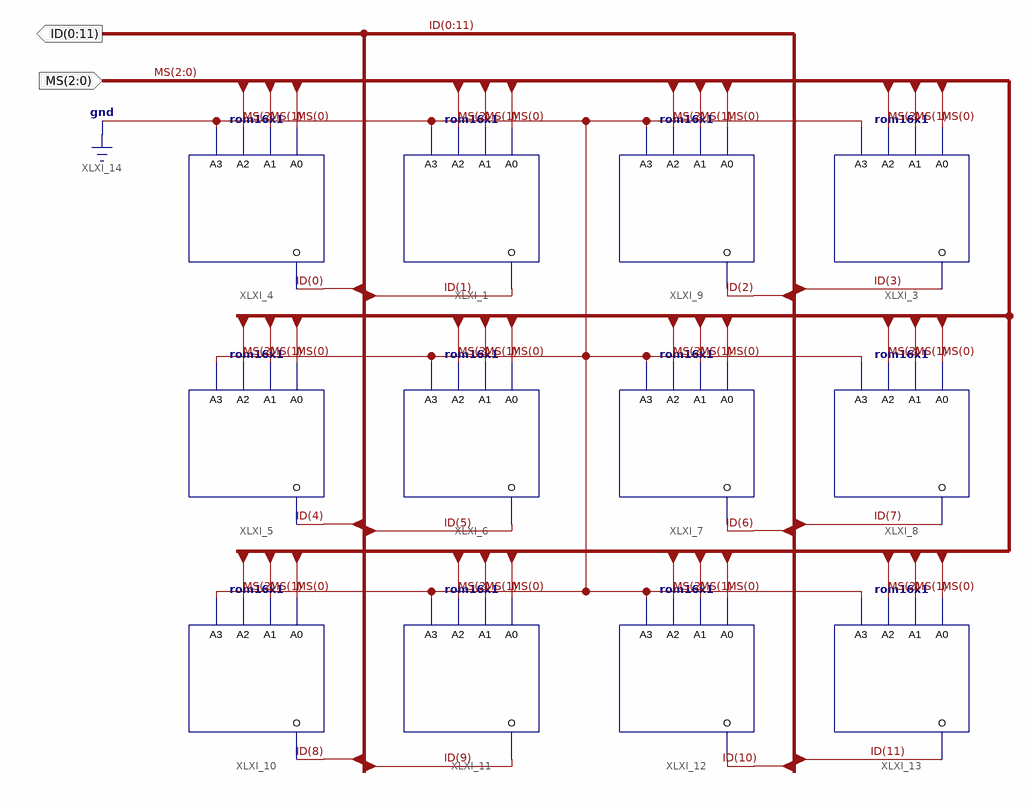
[diagram p0: schematic sheet 1]
// Xilinx ISE schematic Program_ROM.sch (spartan3e) as structural Verilog: 12 symbols, 2 ports
module Program_ROM (
  input  [2:0] MS,
  output [0:11] ID
);

  rom16x1 #(.INIT("0084")) XLXI_1 (.A0(MS[0]), .A1(MS[1]), .A2(MS[2]), .A3(1'b0), .O(ID[1]));
  rom16x1 #(.INIT("00DE")) XLXI_5 (.A0(MS[0]), .A1(MS[1]), .A2(MS[2]), .A3(1'b0), .O(ID[4]));
  rom16x1 #(.INIT("0070")) XLXI_7 (.A0(MS[0]), .A1(MS[1]), .A2(MS[2]), .A3(1'b0), .O(ID[6]));
  rom16x1 #(.INIT("0060")) XLXI_8 (.A0(MS[0]), .A1(MS[1]), .A2(MS[2]), .A3(1'b0), .O(ID[7]));
  rom16x1 #(.INIT("0010")) XLXI_9 (.A0(MS[0]), .A1(MS[1]), .A2(MS[2]), .A3(1'b0), .O(ID[2]));
  rom16x1 XLXI_10 (.A0(MS[0]), .A1(MS[1]), .A2(MS[2]), .A3(1'b0), .O(ID[8]));
  rom16x1 #(.INIT("0000")) XLXI_11 (.A0(MS[0]), .A1(MS[1]), .A2(MS[2]), .A3(1'b0), .O(ID[9]));
  rom16x1 #(.INIT("0081")) XLXI_12 (.A0(MS[0]), .A1(MS[1]), .A2(MS[2]), .A3(1'b0), .O(ID[10]));
  rom16x1 #(.INIT("0037")) XLXI_3 (.A0(MS[0]), .A1(MS[1]), .A2(MS[2]), .A3(1'b0), .O(ID[3]));
  rom16x1 XLXI_6 (.A0(MS[0]), .A1(MS[1]), .A2(MS[2]), .A3(1'b0), .O(ID[5]));
  rom16x1 #(.INIT("008B")) XLXI_13 (.A0(MS[0]), .A1(MS[1]), .A2(MS[2]), .A3(1'b0), .O(ID[11]));
  rom16x1 #(.INIT("008B")) XLXI_4 (.A0(MS[0]), .A1(MS[1]), .A2(MS[2]), .A3(1'b0), .O(ID[0]));
endmodule
